# Altium schematic sheet input3.SchDoc
size A3
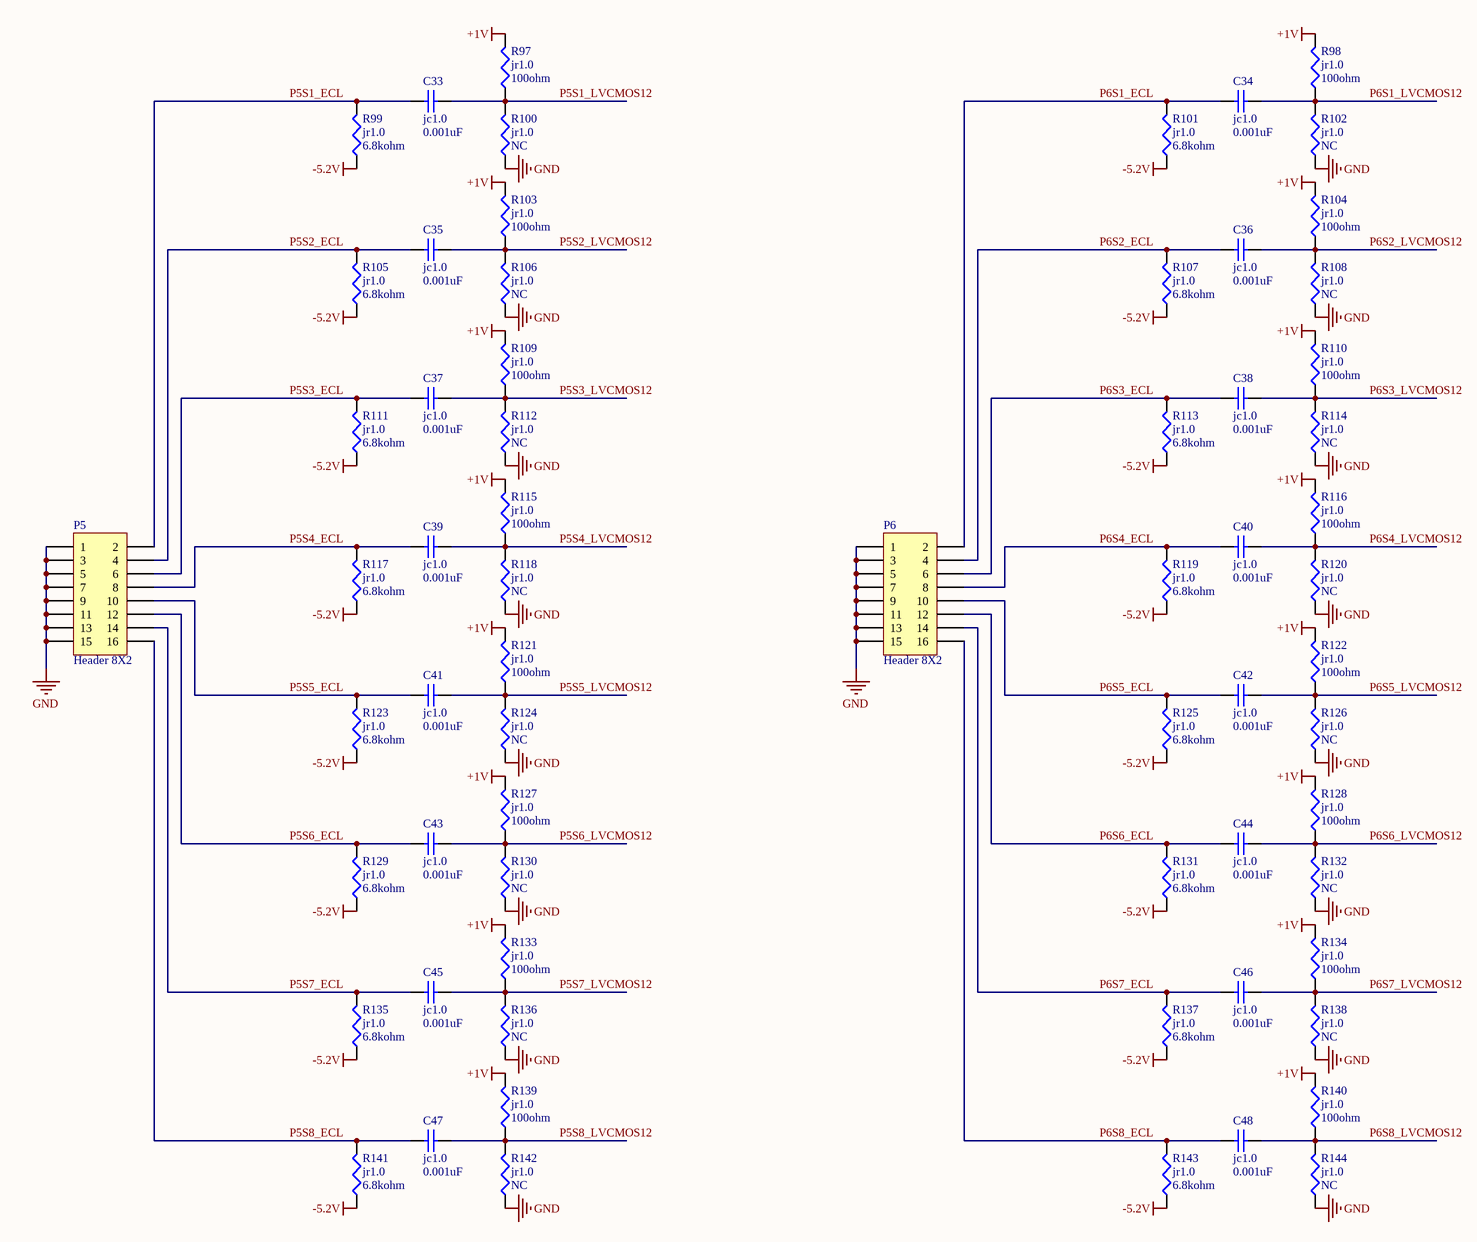
[diagram p0: input3.SchDoc]

## Parts
C33  jc1.0  value 0.001uF  [0402]
C34  jc1.0  value 0.001uF  [0402]
C35  jc1.0  value 0.001uF  [0402]
C36  jc1.0  value 0.001uF  [0402]
C37  jc1.0  value 0.001uF  [0402]
C38  jc1.0  value 0.001uF  [0402]
C39  jc1.0  value 0.001uF  [0402]
C40  jc1.0  value 0.001uF  [0402]
C41  jc1.0  value 0.001uF  [0402]
C42  jc1.0  value 0.001uF  [0402]
C43  jc1.0  value 0.001uF  [0402]
C44  jc1.0  value 0.001uF  [0402]
C45  jc1.0  value 0.001uF  [0402]
C46  jc1.0  value 0.001uF  [0402]
C47  jc1.0  value 0.001uF  [0402]
C48  jc1.0  value 0.001uF  [0402]
P5  Header 8X2  [HDR2X8]
P6  Header 8X2  [HDR2X8]
R97  jr1.0  value 100ohm  [0402]
R98  jr1.0  value 100ohm  [0402]
R99  jr1.0  value 6.8kohm  [0402]
R100  jr1.0  value NC  [0402]
R101  jr1.0  value 6.8kohm  [0402]
R102  jr1.0  value NC  [0402]
R103  jr1.0  value 100ohm  [0402]
R104  jr1.0  value 100ohm  [0402]
R105  jr1.0  value 6.8kohm  [0402]
R106  jr1.0  value NC  [0402]
R107  jr1.0  value 6.8kohm  [0402]
R108  jr1.0  value NC  [0402]
R109  jr1.0  value 100ohm  [0402]
R110  jr1.0  value 100ohm  [0402]
R111  jr1.0  value 6.8kohm  [0402]
R112  jr1.0  value NC  [0402]
R113  jr1.0  value 6.8kohm  [0402]
R114  jr1.0  value NC  [0402]
R115  jr1.0  value 100ohm  [0402]
R116  jr1.0  value 100ohm  [0402]
R117  jr1.0  value 6.8kohm  [0402]
R118  jr1.0  value NC  [0402]
R119  jr1.0  value 6.8kohm  [0402]
R120  jr1.0  value NC  [0402]
R121  jr1.0  value 100ohm  [0402]
R122  jr1.0  value 100ohm  [0402]
R123  jr1.0  value 6.8kohm  [0402]
R124  jr1.0  value NC  [0402]
R125  jr1.0  value 6.8kohm  [0402]
R126  jr1.0  value NC  [0402]
R127  jr1.0  value 100ohm  [0402]
R128  jr1.0  value 100ohm  [0402]
R129  jr1.0  value 6.8kohm  [0402]
R130  jr1.0  value NC  [0402]
R131  jr1.0  value 6.8kohm  [0402]
R132  jr1.0  value NC  [0402]
R133  jr1.0  value 100ohm  [0402]
R134  jr1.0  value 100ohm  [0402]
R135  jr1.0  value 6.8kohm  [0402]
R136  jr1.0  value NC  [0402]
R137  jr1.0  value 6.8kohm  [0402]
R138  jr1.0  value NC  [0402]
R139  jr1.0  value 100ohm  [0402]
R140  jr1.0  value 100ohm  [0402]
R141  jr1.0  value 6.8kohm  [0402]
R142  jr1.0  value NC  [0402]
R143  jr1.0  value 6.8kohm  [0402]
R144  jr1.0  value NC  [0402]

## Nets
+1V: R97.2 R98.2 R103.2 R104.2 R109.2 R110.2 R115.2 R116.2 R121.2 R122.2 R127.2 R128.2 R133.2 R134.2 R139.2 R140.2
-5.2V: R99.1 R101.1 R105.1 R107.1 R111.1 R113.1 R117.1 R119.1 R123.1 R125.1 R129.1 R131.1 R135.1 R137.1 R141.1 R143.1
GND: P5.1 P5.3 P5.5 P5.7 P5.9 P5.11 P5.13 P5.15 P6.1 P6.3 P6.5 P6.7 P6.9 P6.11 P6.13 P6.15 R100.1 R102.1 R106.1 R108.1 R112.1 R114.1 R118.1 R120.1 R124.1 R126.1 R130.1 R132.1 R136.1 R138.1 R142.1 R144.1
P5S1_ECL: C33.1 P5.2 R99.2
P5S1_LVCMOS12: C33.2 R97.1 R100.2
P5S2_ECL: C35.1 P5.4 R105.2
P5S2_LVCMOS12: C35.2 R103.1 R106.2
P5S3_ECL: C37.1 P5.6 R111.2
P5S3_LVCMOS12: C37.2 R109.1 R112.2
P5S4_ECL: C39.1 P5.8 R117.2
P5S4_LVCMOS12: C39.2 R115.1 R118.2
P5S5_ECL: C41.1 P5.10 R123.2
P5S5_LVCMOS12: C41.2 R121.1 R124.2
P5S6_ECL: C43.1 P5.12 R129.2
P5S6_LVCMOS12: C43.2 R127.1 R130.2
P5S7_ECL: C45.1 P5.14 R135.2
P5S7_LVCMOS12: C45.2 R133.1 R136.2
P5S8_ECL: C47.1 P5.16 R141.2
P5S8_LVCMOS12: C47.2 R139.1 R142.2
P6S1_ECL: C34.1 P6.2 R101.2
P6S1_LVCMOS12: C34.2 R98.1 R102.2
P6S2_ECL: C36.1 P6.4 R107.2
P6S2_LVCMOS12: C36.2 R104.1 R108.2
P6S3_ECL: C38.1 P6.6 R113.2
P6S3_LVCMOS12: C38.2 R110.1 R114.2
P6S4_ECL: C40.1 P6.8 R119.2
P6S4_LVCMOS12: C40.2 R116.1 R120.2
P6S5_ECL: C42.1 P6.10 R125.2
P6S5_LVCMOS12: C42.2 R122.1 R126.2
P6S6_ECL: C44.1 P6.12 R131.2
P6S6_LVCMOS12: C44.2 R128.1 R132.2
P6S7_ECL: C46.1 P6.14 R137.2
P6S7_LVCMOS12: C46.2 R134.1 R138.2
P6S8_ECL: C48.1 P6.16 R143.2
P6S8_LVCMOS12: C48.2 R140.1 R144.2

## Library data of the parts
C33-C48 = Cap: Capacitor; Published: 8-Jun-2000; LatestRevisionDate: 17-Jul-2002; LatestRevisionNote: Re-released for DXP Platform.; PackageReference: RAD-0.3; Publisher: Altium Limited
P5 P6 = Header 8X2: Header, 8-Pin, Dual row; LatestRevisionDate: 17-Jul-2002; LatestRevisionNote: Re-released for DXP Platform.; Publisher: Altium Limited
R97-R144 = Res: Resistor; Published: 8-Jun-2000; LatestRevisionDate: 04-Mar-2005; LatestRevisionNote: PCB Footprint replaced.; PackageReference: J1-0603; Publisher: Altium Limited